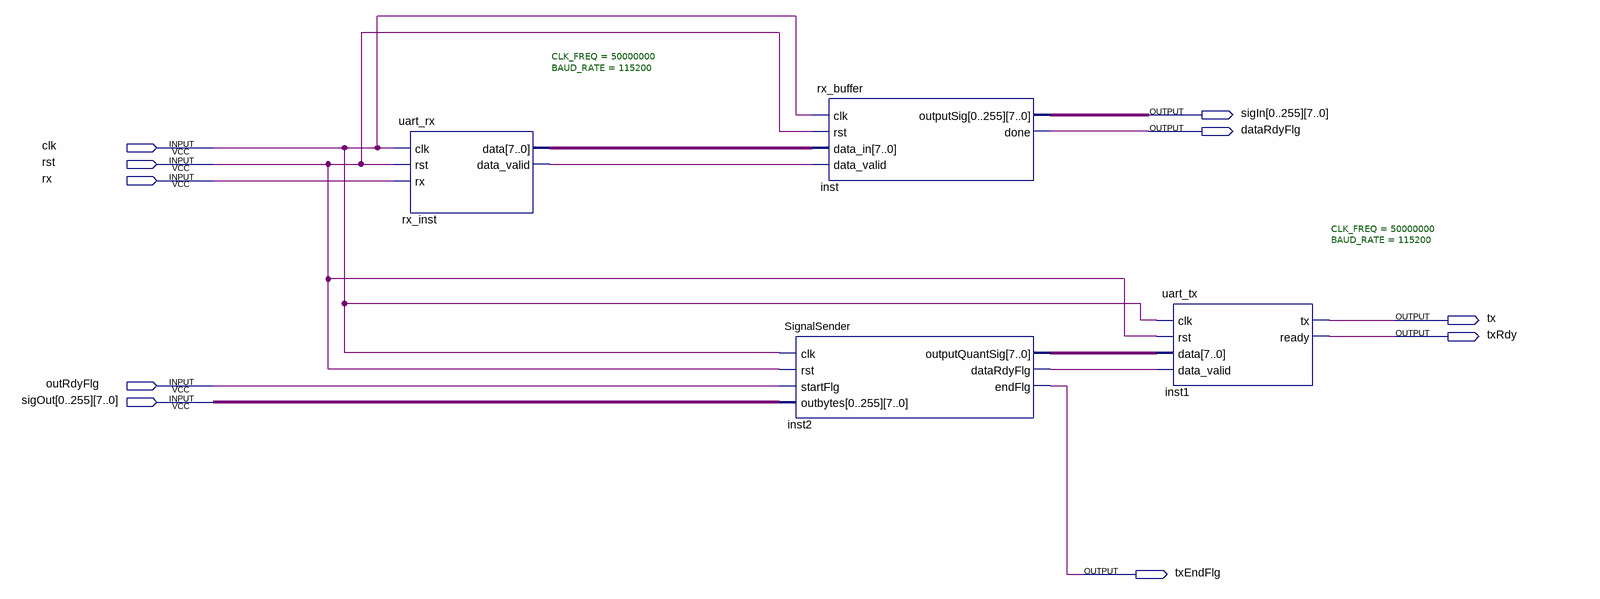
[diagram p0: schematic sheet]
// Quartus schematic UART_TXRX.bdf as structural Verilog: 4 symbols, 10 pins
module UART_TXRX (
  input  clk,
  input  rst,
  input  rx,
  input  outRdyFlg,
  input  [7:0] sigOut_0,
  input  [7:0] sigOut_1,
  input  [7:0] sigOut_2,
  input  [7:0] sigOut_3,
  input  [7:0] sigOut_4,
  input  [7:0] sigOut_5,
  input  [7:0] sigOut_6,
  input  [7:0] sigOut_7,
  input  [7:0] sigOut_8,
  input  [7:0] sigOut_9,
  input  [7:0] sigOut_10,
  input  [7:0] sigOut_11,
  input  [7:0] sigOut_12,
  input  [7:0] sigOut_13,
  input  [7:0] sigOut_14,
  input  [7:0] sigOut_15,
  input  [7:0] sigOut_16,
  input  [7:0] sigOut_17,
  input  [7:0] sigOut_18,
  input  [7:0] sigOut_19,
  input  [7:0] sigOut_20,
  input  [7:0] sigOut_21,
  input  [7:0] sigOut_22,
  input  [7:0] sigOut_23,
  input  [7:0] sigOut_24,
  input  [7:0] sigOut_25,
  input  [7:0] sigOut_26,
  input  [7:0] sigOut_27,
  input  [7:0] sigOut_28,
  input  [7:0] sigOut_29,
  input  [7:0] sigOut_30,
  input  [7:0] sigOut_31,
  input  [7:0] sigOut_32,
  input  [7:0] sigOut_33,
  input  [7:0] sigOut_34,
  input  [7:0] sigOut_35,
  input  [7:0] sigOut_36,
  input  [7:0] sigOut_37,
  input  [7:0] sigOut_38,
  input  [7:0] sigOut_39,
  input  [7:0] sigOut_40,
  input  [7:0] sigOut_41,
  input  [7:0] sigOut_42,
  input  [7:0] sigOut_43,
  input  [7:0] sigOut_44,
  input  [7:0] sigOut_45,
  input  [7:0] sigOut_46,
  input  [7:0] sigOut_47,
  input  [7:0] sigOut_48,
  input  [7:0] sigOut_49,
  input  [7:0] sigOut_50,
  input  [7:0] sigOut_51,
  input  [7:0] sigOut_52,
  input  [7:0] sigOut_53,
  input  [7:0] sigOut_54,
  input  [7:0] sigOut_55,
  input  [7:0] sigOut_56,
  input  [7:0] sigOut_57,
  input  [7:0] sigOut_58,
  input  [7:0] sigOut_59,
  input  [7:0] sigOut_60,
  input  [7:0] sigOut_61,
  input  [7:0] sigOut_62,
  input  [7:0] sigOut_63,
  input  [7:0] sigOut_64,
  input  [7:0] sigOut_65,
  input  [7:0] sigOut_66,
  input  [7:0] sigOut_67,
  input  [7:0] sigOut_68,
  input  [7:0] sigOut_69,
  input  [7:0] sigOut_70,
  input  [7:0] sigOut_71,
  input  [7:0] sigOut_72,
  input  [7:0] sigOut_73,
  input  [7:0] sigOut_74,
  input  [7:0] sigOut_75,
  input  [7:0] sigOut_76,
  input  [7:0] sigOut_77,
  input  [7:0] sigOut_78,
  input  [7:0] sigOut_79,
  input  [7:0] sigOut_80,
  input  [7:0] sigOut_81,
  input  [7:0] sigOut_82,
  input  [7:0] sigOut_83,
  input  [7:0] sigOut_84,
  input  [7:0] sigOut_85,
  input  [7:0] sigOut_86,
  input  [7:0] sigOut_87,
  input  [7:0] sigOut_88,
  input  [7:0] sigOut_89,
  input  [7:0] sigOut_90,
  input  [7:0] sigOut_91,
  input  [7:0] sigOut_92,
  input  [7:0] sigOut_93,
  input  [7:0] sigOut_94,
  input  [7:0] sigOut_95,
  input  [7:0] sigOut_96,
  input  [7:0] sigOut_97,
  input  [7:0] sigOut_98,
  input  [7:0] sigOut_99,
  input  [7:0] sigOut_100,
  input  [7:0] sigOut_101,
  input  [7:0] sigOut_102,
  input  [7:0] sigOut_103,
  input  [7:0] sigOut_104,
  input  [7:0] sigOut_105,
  input  [7:0] sigOut_106,
  input  [7:0] sigOut_107,
  input  [7:0] sigOut_108,
  input  [7:0] sigOut_109,
  input  [7:0] sigOut_110,
  input  [7:0] sigOut_111,
  input  [7:0] sigOut_112,
  input  [7:0] sigOut_113,
  input  [7:0] sigOut_114,
  input  [7:0] sigOut_115,
  input  [7:0] sigOut_116,
  input  [7:0] sigOut_117,
  input  [7:0] sigOut_118,
  input  [7:0] sigOut_119,
  input  [7:0] sigOut_120,
  input  [7:0] sigOut_121,
  input  [7:0] sigOut_122,
  input  [7:0] sigOut_123,
  input  [7:0] sigOut_124,
  input  [7:0] sigOut_125,
  input  [7:0] sigOut_126,
  input  [7:0] sigOut_127,
  input  [7:0] sigOut_128,
  input  [7:0] sigOut_129,
  input  [7:0] sigOut_130,
  input  [7:0] sigOut_131,
  input  [7:0] sigOut_132,
  input  [7:0] sigOut_133,
  input  [7:0] sigOut_134,
  input  [7:0] sigOut_135,
  input  [7:0] sigOut_136,
  input  [7:0] sigOut_137,
  input  [7:0] sigOut_138,
  input  [7:0] sigOut_139,
  input  [7:0] sigOut_140,
  input  [7:0] sigOut_141,
  input  [7:0] sigOut_142,
  input  [7:0] sigOut_143,
  input  [7:0] sigOut_144,
  input  [7:0] sigOut_145,
  input  [7:0] sigOut_146,
  input  [7:0] sigOut_147,
  input  [7:0] sigOut_148,
  input  [7:0] sigOut_149,
  input  [7:0] sigOut_150,
  input  [7:0] sigOut_151,
  input  [7:0] sigOut_152,
  input  [7:0] sigOut_153,
  input  [7:0] sigOut_154,
  input  [7:0] sigOut_155,
  input  [7:0] sigOut_156,
  input  [7:0] sigOut_157,
  input  [7:0] sigOut_158,
  input  [7:0] sigOut_159,
  input  [7:0] sigOut_160,
  input  [7:0] sigOut_161,
  input  [7:0] sigOut_162,
  input  [7:0] sigOut_163,
  input  [7:0] sigOut_164,
  input  [7:0] sigOut_165,
  input  [7:0] sigOut_166,
  input  [7:0] sigOut_167,
  input  [7:0] sigOut_168,
  input  [7:0] sigOut_169,
  input  [7:0] sigOut_170,
  input  [7:0] sigOut_171,
  input  [7:0] sigOut_172,
  input  [7:0] sigOut_173,
  input  [7:0] sigOut_174,
  input  [7:0] sigOut_175,
  input  [7:0] sigOut_176,
  input  [7:0] sigOut_177,
  input  [7:0] sigOut_178,
  input  [7:0] sigOut_179,
  input  [7:0] sigOut_180,
  input  [7:0] sigOut_181,
  input  [7:0] sigOut_182,
  input  [7:0] sigOut_183,
  input  [7:0] sigOut_184,
  input  [7:0] sigOut_185,
  input  [7:0] sigOut_186,
  input  [7:0] sigOut_187,
  input  [7:0] sigOut_188,
  input  [7:0] sigOut_189,
  input  [7:0] sigOut_190,
  input  [7:0] sigOut_191,
  input  [7:0] sigOut_192,
  input  [7:0] sigOut_193,
  input  [7:0] sigOut_194,
  input  [7:0] sigOut_195,
  input  [7:0] sigOut_196,
  input  [7:0] sigOut_197,
  input  [7:0] sigOut_198,
  input  [7:0] sigOut_199,
  input  [7:0] sigOut_200,
  input  [7:0] sigOut_201,
  input  [7:0] sigOut_202,
  input  [7:0] sigOut_203,
  input  [7:0] sigOut_204,
  input  [7:0] sigOut_205,
  input  [7:0] sigOut_206,
  input  [7:0] sigOut_207,
  input  [7:0] sigOut_208,
  input  [7:0] sigOut_209,
  input  [7:0] sigOut_210,
  input  [7:0] sigOut_211,
  input  [7:0] sigOut_212,
  input  [7:0] sigOut_213,
  input  [7:0] sigOut_214,
  input  [7:0] sigOut_215,
  input  [7:0] sigOut_216,
  input  [7:0] sigOut_217,
  input  [7:0] sigOut_218,
  input  [7:0] sigOut_219,
  input  [7:0] sigOut_220,
  input  [7:0] sigOut_221,
  input  [7:0] sigOut_222,
  input  [7:0] sigOut_223,
  input  [7:0] sigOut_224,
  input  [7:0] sigOut_225,
  input  [7:0] sigOut_226,
  input  [7:0] sigOut_227,
  input  [7:0] sigOut_228,
  input  [7:0] sigOut_229,
  input  [7:0] sigOut_230,
  input  [7:0] sigOut_231,
  input  [7:0] sigOut_232,
  input  [7:0] sigOut_233,
  input  [7:0] sigOut_234,
  input  [7:0] sigOut_235,
  input  [7:0] sigOut_236,
  input  [7:0] sigOut_237,
  input  [7:0] sigOut_238,
  input  [7:0] sigOut_239,
  input  [7:0] sigOut_240,
  input  [7:0] sigOut_241,
  input  [7:0] sigOut_242,
  input  [7:0] sigOut_243,
  input  [7:0] sigOut_244,
  input  [7:0] sigOut_245,
  input  [7:0] sigOut_246,
  input  [7:0] sigOut_247,
  input  [7:0] sigOut_248,
  input  [7:0] sigOut_249,
  input  [7:0] sigOut_250,
  input  [7:0] sigOut_251,
  input  [7:0] sigOut_252,
  input  [7:0] sigOut_253,
  input  [7:0] sigOut_254,
  input  [7:0] sigOut_255,
  output [7:0] sigIn_0,
  output [7:0] sigIn_1,
  output [7:0] sigIn_2,
  output [7:0] sigIn_3,
  output [7:0] sigIn_4,
  output [7:0] sigIn_5,
  output [7:0] sigIn_6,
  output [7:0] sigIn_7,
  output [7:0] sigIn_8,
  output [7:0] sigIn_9,
  output [7:0] sigIn_10,
  output [7:0] sigIn_11,
  output [7:0] sigIn_12,
  output [7:0] sigIn_13,
  output [7:0] sigIn_14,
  output [7:0] sigIn_15,
  output [7:0] sigIn_16,
  output [7:0] sigIn_17,
  output [7:0] sigIn_18,
  output [7:0] sigIn_19,
  output [7:0] sigIn_20,
  output [7:0] sigIn_21,
  output [7:0] sigIn_22,
  output [7:0] sigIn_23,
  output [7:0] sigIn_24,
  output [7:0] sigIn_25,
  output [7:0] sigIn_26,
  output [7:0] sigIn_27,
  output [7:0] sigIn_28,
  output [7:0] sigIn_29,
  output [7:0] sigIn_30,
  output [7:0] sigIn_31,
  output [7:0] sigIn_32,
  output [7:0] sigIn_33,
  output [7:0] sigIn_34,
  output [7:0] sigIn_35,
  output [7:0] sigIn_36,
  output [7:0] sigIn_37,
  output [7:0] sigIn_38,
  output [7:0] sigIn_39,
  output [7:0] sigIn_40,
  output [7:0] sigIn_41,
  output [7:0] sigIn_42,
  output [7:0] sigIn_43,
  output [7:0] sigIn_44,
  output [7:0] sigIn_45,
  output [7:0] sigIn_46,
  output [7:0] sigIn_47,
  output [7:0] sigIn_48,
  output [7:0] sigIn_49,
  output [7:0] sigIn_50,
  output [7:0] sigIn_51,
  output [7:0] sigIn_52,
  output [7:0] sigIn_53,
  output [7:0] sigIn_54,
  output [7:0] sigIn_55,
  output [7:0] sigIn_56,
  output [7:0] sigIn_57,
  output [7:0] sigIn_58,
  output [7:0] sigIn_59,
  output [7:0] sigIn_60,
  output [7:0] sigIn_61,
  output [7:0] sigIn_62,
  output [7:0] sigIn_63,
  output [7:0] sigIn_64,
  output [7:0] sigIn_65,
  output [7:0] sigIn_66,
  output [7:0] sigIn_67,
  output [7:0] sigIn_68,
  output [7:0] sigIn_69,
  output [7:0] sigIn_70,
  output [7:0] sigIn_71,
  output [7:0] sigIn_72,
  output [7:0] sigIn_73,
  output [7:0] sigIn_74,
  output [7:0] sigIn_75,
  output [7:0] sigIn_76,
  output [7:0] sigIn_77,
  output [7:0] sigIn_78,
  output [7:0] sigIn_79,
  output [7:0] sigIn_80,
  output [7:0] sigIn_81,
  output [7:0] sigIn_82,
  output [7:0] sigIn_83,
  output [7:0] sigIn_84,
  output [7:0] sigIn_85,
  output [7:0] sigIn_86,
  output [7:0] sigIn_87,
  output [7:0] sigIn_88,
  output [7:0] sigIn_89,
  output [7:0] sigIn_90,
  output [7:0] sigIn_91,
  output [7:0] sigIn_92,
  output [7:0] sigIn_93,
  output [7:0] sigIn_94,
  output [7:0] sigIn_95,
  output [7:0] sigIn_96,
  output [7:0] sigIn_97,
  output [7:0] sigIn_98,
  output [7:0] sigIn_99,
  output [7:0] sigIn_100,
  output [7:0] sigIn_101,
  output [7:0] sigIn_102,
  output [7:0] sigIn_103,
  output [7:0] sigIn_104,
  output [7:0] sigIn_105,
  output [7:0] sigIn_106,
  output [7:0] sigIn_107,
  output [7:0] sigIn_108,
  output [7:0] sigIn_109,
  output [7:0] sigIn_110,
  output [7:0] sigIn_111,
  output [7:0] sigIn_112,
  output [7:0] sigIn_113,
  output [7:0] sigIn_114,
  output [7:0] sigIn_115,
  output [7:0] sigIn_116,
  output [7:0] sigIn_117,
  output [7:0] sigIn_118,
  output [7:0] sigIn_119,
  output [7:0] sigIn_120,
  output [7:0] sigIn_121,
  output [7:0] sigIn_122,
  output [7:0] sigIn_123,
  output [7:0] sigIn_124,
  output [7:0] sigIn_125,
  output [7:0] sigIn_126,
  output [7:0] sigIn_127,
  output [7:0] sigIn_128,
  output [7:0] sigIn_129,
  output [7:0] sigIn_130,
  output [7:0] sigIn_131,
  output [7:0] sigIn_132,
  output [7:0] sigIn_133,
  output [7:0] sigIn_134,
  output [7:0] sigIn_135,
  output [7:0] sigIn_136,
  output [7:0] sigIn_137,
  output [7:0] sigIn_138,
  output [7:0] sigIn_139,
  output [7:0] sigIn_140,
  output [7:0] sigIn_141,
  output [7:0] sigIn_142,
  output [7:0] sigIn_143,
  output [7:0] sigIn_144,
  output [7:0] sigIn_145,
  output [7:0] sigIn_146,
  output [7:0] sigIn_147,
  output [7:0] sigIn_148,
  output [7:0] sigIn_149,
  output [7:0] sigIn_150,
  output [7:0] sigIn_151,
  output [7:0] sigIn_152,
  output [7:0] sigIn_153,
  output [7:0] sigIn_154,
  output [7:0] sigIn_155,
  output [7:0] sigIn_156,
  output [7:0] sigIn_157,
  output [7:0] sigIn_158,
  output [7:0] sigIn_159,
  output [7:0] sigIn_160,
  output [7:0] sigIn_161,
  output [7:0] sigIn_162,
  output [7:0] sigIn_163,
  output [7:0] sigIn_164,
  output [7:0] sigIn_165,
  output [7:0] sigIn_166,
  output [7:0] sigIn_167,
  output [7:0] sigIn_168,
  output [7:0] sigIn_169,
  output [7:0] sigIn_170,
  output [7:0] sigIn_171,
  output [7:0] sigIn_172,
  output [7:0] sigIn_173,
  output [7:0] sigIn_174,
  output [7:0] sigIn_175,
  output [7:0] sigIn_176,
  output [7:0] sigIn_177,
  output [7:0] sigIn_178,
  output [7:0] sigIn_179,
  output [7:0] sigIn_180,
  output [7:0] sigIn_181,
  output [7:0] sigIn_182,
  output [7:0] sigIn_183,
  output [7:0] sigIn_184,
  output [7:0] sigIn_185,
  output [7:0] sigIn_186,
  output [7:0] sigIn_187,
  output [7:0] sigIn_188,
  output [7:0] sigIn_189,
  output [7:0] sigIn_190,
  output [7:0] sigIn_191,
  output [7:0] sigIn_192,
  output [7:0] sigIn_193,
  output [7:0] sigIn_194,
  output [7:0] sigIn_195,
  output [7:0] sigIn_196,
  output [7:0] sigIn_197,
  output [7:0] sigIn_198,
  output [7:0] sigIn_199,
  output [7:0] sigIn_200,
  output [7:0] sigIn_201,
  output [7:0] sigIn_202,
  output [7:0] sigIn_203,
  output [7:0] sigIn_204,
  output [7:0] sigIn_205,
  output [7:0] sigIn_206,
  output [7:0] sigIn_207,
  output [7:0] sigIn_208,
  output [7:0] sigIn_209,
  output [7:0] sigIn_210,
  output [7:0] sigIn_211,
  output [7:0] sigIn_212,
  output [7:0] sigIn_213,
  output [7:0] sigIn_214,
  output [7:0] sigIn_215,
  output [7:0] sigIn_216,
  output [7:0] sigIn_217,
  output [7:0] sigIn_218,
  output [7:0] sigIn_219,
  output [7:0] sigIn_220,
  output [7:0] sigIn_221,
  output [7:0] sigIn_222,
  output [7:0] sigIn_223,
  output [7:0] sigIn_224,
  output [7:0] sigIn_225,
  output [7:0] sigIn_226,
  output [7:0] sigIn_227,
  output [7:0] sigIn_228,
  output [7:0] sigIn_229,
  output [7:0] sigIn_230,
  output [7:0] sigIn_231,
  output [7:0] sigIn_232,
  output [7:0] sigIn_233,
  output [7:0] sigIn_234,
  output [7:0] sigIn_235,
  output [7:0] sigIn_236,
  output [7:0] sigIn_237,
  output [7:0] sigIn_238,
  output [7:0] sigIn_239,
  output [7:0] sigIn_240,
  output [7:0] sigIn_241,
  output [7:0] sigIn_242,
  output [7:0] sigIn_243,
  output [7:0] sigIn_244,
  output [7:0] sigIn_245,
  output [7:0] sigIn_246,
  output [7:0] sigIn_247,
  output [7:0] sigIn_248,
  output [7:0] sigIn_249,
  output [7:0] sigIn_250,
  output [7:0] sigIn_251,
  output [7:0] sigIn_252,
  output [7:0] sigIn_253,
  output [7:0] sigIn_254,
  output [7:0] sigIn_255,
  output dataRdyFlg,
  output tx,
  output txRdy,
  output txEndFlg
);

  wire inst2_datardyflg, rx_inst_data_valid;
  wire [7:0] inst2_outputquantsig, rx_inst_data;

  uart_rx #(.CLK_FREQ(50000000), .BAUD_RATE(115200)) rx_inst (
    .clk(clk), .rst(rst), .rx(rx), .data(rx_inst_data), .data_valid(rx_inst_data_valid));
  rx_buffer inst (
    .clk(clk), .rst(rst), .data_in(rx_inst_data), .data_valid(rx_inst_data_valid),
    .outputSig({sigIn_0, sigIn_1, sigIn_2, sigIn_3, sigIn_4, sigIn_5, sigIn_6, sigIn_7, sigIn_8, sigIn_9, sigIn_10, sigIn_11, sigIn_12, sigIn_13, sigIn_14, sigIn_15, sigIn_16, sigIn_17, sigIn_18, sigIn_19, sigIn_20, sigIn_21, sigIn_22, sigIn_23, sigIn_24, sigIn_25, sigIn_26, sigIn_27, sigIn_28, sigIn_29, sigIn_30, sigIn_31, sigIn_32, sigIn_33, sigIn_34, sigIn_35, sigIn_36, sigIn_37, sigIn_38, sigIn_39, sigIn_40, sigIn_41, sigIn_42, sigIn_43, sigIn_44, sigIn_45, sigIn_46, sigIn_47, sigIn_48, sigIn_49, sigIn_50, sigIn_51, sigIn_52, sigIn_53, sigIn_54, sigIn_55, sigIn_56, sigIn_57, sigIn_58, sigIn_59, sigIn_60, sigIn_61, sigIn_62, sigIn_63, sigIn_64, sigIn_65, sigIn_66, sigIn_67, sigIn_68, sigIn_69, sigIn_70, sigIn_71, sigIn_72, sigIn_73, sigIn_74, sigIn_75, sigIn_76, sigIn_77, sigIn_78, sigIn_79, sigIn_80, sigIn_81, sigIn_82, sigIn_83, sigIn_84, sigIn_85, sigIn_86, sigIn_87, sigIn_88, sigIn_89, sigIn_90, sigIn_91, sigIn_92, sigIn_93, sigIn_94, sigIn_95, sigIn_96, sigIn_97, sigIn_98, sigIn_99, sigIn_100, sigIn_101, sigIn_102, sigIn_103, sigIn_104, sigIn_105, sigIn_106, sigIn_107, sigIn_108, sigIn_109, sigIn_110, sigIn_111, sigIn_112, sigIn_113, sigIn_114, sigIn_115, sigIn_116, sigIn_117, sigIn_118, sigIn_119, sigIn_120, sigIn_121, sigIn_122, sigIn_123, sigIn_124, sigIn_125, sigIn_126, sigIn_127, sigIn_128, sigIn_129, sigIn_130, sigIn_131, sigIn_132, sigIn_133, sigIn_134, sigIn_135, sigIn_136, sigIn_137, sigIn_138, sigIn_139, sigIn_140, sigIn_141, sigIn_142, sigIn_143, sigIn_144, sigIn_145, sigIn_146, sigIn_147, sigIn_148, sigIn_149, sigIn_150, sigIn_151, sigIn_152, sigIn_153, sigIn_154, sigIn_155, sigIn_156, sigIn_157, sigIn_158, sigIn_159, sigIn_160, sigIn_161, sigIn_162, sigIn_163, sigIn_164, sigIn_165, sigIn_166, sigIn_167, sigIn_168, sigIn_169, sigIn_170, sigIn_171, sigIn_172, sigIn_173, sigIn_174, sigIn_175, sigIn_176, sigIn_177, sigIn_178, sigIn_179, sigIn_180, sigIn_181, sigIn_182, sigIn_183, sigIn_184, sigIn_185, sigIn_186, sigIn_187, sigIn_188, sigIn_189, sigIn_190, sigIn_191, sigIn_192, sigIn_193, sigIn_194, sigIn_195, sigIn_196, sigIn_197, sigIn_198, sigIn_199, sigIn_200, sigIn_201, sigIn_202, sigIn_203, sigIn_204, sigIn_205, sigIn_206, sigIn_207, sigIn_208, sigIn_209, sigIn_210, sigIn_211, sigIn_212, sigIn_213, sigIn_214, sigIn_215, sigIn_216, sigIn_217, sigIn_218, sigIn_219, sigIn_220, sigIn_221, sigIn_222, sigIn_223, sigIn_224, sigIn_225, sigIn_226, sigIn_227, sigIn_228, sigIn_229, sigIn_230, sigIn_231, sigIn_232, sigIn_233, sigIn_234, sigIn_235, sigIn_236, sigIn_237, sigIn_238, sigIn_239, sigIn_240, sigIn_241, sigIn_242, sigIn_243, sigIn_244, sigIn_245, sigIn_246, sigIn_247, sigIn_248, sigIn_249, sigIn_250, sigIn_251, sigIn_252, sigIn_253, sigIn_254, sigIn_255}),
    .done(dataRdyFlg));
  SignalSender inst2 (
    .clk(clk), .rst(rst), .startFlg(outRdyFlg),
    .outbytes({sigOut_0, sigOut_1, sigOut_2, sigOut_3, sigOut_4, sigOut_5, sigOut_6, sigOut_7, sigOut_8, sigOut_9, sigOut_10, sigOut_11, sigOut_12, sigOut_13, sigOut_14, sigOut_15, sigOut_16, sigOut_17, sigOut_18, sigOut_19, sigOut_20, sigOut_21, sigOut_22, sigOut_23, sigOut_24, sigOut_25, sigOut_26, sigOut_27, sigOut_28, sigOut_29, sigOut_30, sigOut_31, sigOut_32, sigOut_33, sigOut_34, sigOut_35, sigOut_36, sigOut_37, sigOut_38, sigOut_39, sigOut_40, sigOut_41, sigOut_42, sigOut_43, sigOut_44, sigOut_45, sigOut_46, sigOut_47, sigOut_48, sigOut_49, sigOut_50, sigOut_51, sigOut_52, sigOut_53, sigOut_54, sigOut_55, sigOut_56, sigOut_57, sigOut_58, sigOut_59, sigOut_60, sigOut_61, sigOut_62, sigOut_63, sigOut_64, sigOut_65, sigOut_66, sigOut_67, sigOut_68, sigOut_69, sigOut_70, sigOut_71, sigOut_72, sigOut_73, sigOut_74, sigOut_75, sigOut_76, sigOut_77, sigOut_78, sigOut_79, sigOut_80, sigOut_81, sigOut_82, sigOut_83, sigOut_84, sigOut_85, sigOut_86, sigOut_87, sigOut_88, sigOut_89, sigOut_90, sigOut_91, sigOut_92, sigOut_93, sigOut_94, sigOut_95, sigOut_96, sigOut_97, sigOut_98, sigOut_99, sigOut_100, sigOut_101, sigOut_102, sigOut_103, sigOut_104, sigOut_105, sigOut_106, sigOut_107, sigOut_108, sigOut_109, sigOut_110, sigOut_111, sigOut_112, sigOut_113, sigOut_114, sigOut_115, sigOut_116, sigOut_117, sigOut_118, sigOut_119, sigOut_120, sigOut_121, sigOut_122, sigOut_123, sigOut_124, sigOut_125, sigOut_126, sigOut_127, sigOut_128, sigOut_129, sigOut_130, sigOut_131, sigOut_132, sigOut_133, sigOut_134, sigOut_135, sigOut_136, sigOut_137, sigOut_138, sigOut_139, sigOut_140, sigOut_141, sigOut_142, sigOut_143, sigOut_144, sigOut_145, sigOut_146, sigOut_147, sigOut_148, sigOut_149, sigOut_150, sigOut_151, sigOut_152, sigOut_153, sigOut_154, sigOut_155, sigOut_156, sigOut_157, sigOut_158, sigOut_159, sigOut_160, sigOut_161, sigOut_162, sigOut_163, sigOut_164, sigOut_165, sigOut_166, sigOut_167, sigOut_168, sigOut_169, sigOut_170, sigOut_171, sigOut_172, sigOut_173, sigOut_174, sigOut_175, sigOut_176, sigOut_177, sigOut_178, sigOut_179, sigOut_180, sigOut_181, sigOut_182, sigOut_183, sigOut_184, sigOut_185, sigOut_186, sigOut_187, sigOut_188, sigOut_189, sigOut_190, sigOut_191, sigOut_192, sigOut_193, sigOut_194, sigOut_195, sigOut_196, sigOut_197, sigOut_198, sigOut_199, sigOut_200, sigOut_201, sigOut_202, sigOut_203, sigOut_204, sigOut_205, sigOut_206, sigOut_207, sigOut_208, sigOut_209, sigOut_210, sigOut_211, sigOut_212, sigOut_213, sigOut_214, sigOut_215, sigOut_216, sigOut_217, sigOut_218, sigOut_219, sigOut_220, sigOut_221, sigOut_222, sigOut_223, sigOut_224, sigOut_225, sigOut_226, sigOut_227, sigOut_228, sigOut_229, sigOut_230, sigOut_231, sigOut_232, sigOut_233, sigOut_234, sigOut_235, sigOut_236, sigOut_237, sigOut_238, sigOut_239, sigOut_240, sigOut_241, sigOut_242, sigOut_243, sigOut_244, sigOut_245, sigOut_246, sigOut_247, sigOut_248, sigOut_249, sigOut_250, sigOut_251, sigOut_252, sigOut_253, sigOut_254, sigOut_255}),
    .outputQuantSig(inst2_outputquantsig), .dataRdyFlg(inst2_datardyflg), .endFlg(txEndFlg));
  uart_tx #(.CLK_FREQ(50000000), .BAUD_RATE(115200)) inst1 (
    .clk(clk), .rst(rst), .data(inst2_outputquantsig), .data_valid(inst2_datardyflg), .tx(tx), .ready(txRdy));
endmodule
